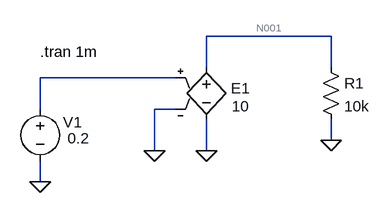
[diagram p0: schematic VoltageSource_VoltageDependent.asc]
VoltageSource_VoltageDependent.asc, the LTspice schematic file:
Version 4.1
SHEET 1 880 680
WIRE 448 48 256 48
WIRE 256 96 256 48
WIRE 448 96 448 48
WIRE 208 112 0 112
WIRE 0 160 0 112
WIRE 208 160 176 160
WIRE 448 208 448 176
WIRE 176 224 176 160
WIRE 256 224 256 176
WIRE 0 272 0 240
FLAG 256 224 0
FLAG 448 208 0
FLAG 0 272 0
FLAG 176 224 0
SYMBOL voltage 0 144 R0
WINDOW 123 0 0 Left 0
WINDOW 39 0 0 Left 0
WINDOW 0 35 36 Left 2
WINDOW 3 42 61 Left 2
SYMATTR InstName V1
SYMATTR Value 0.2
SYMBOL e 256 80 R0
WINDOW 0 38 48 Left 2
WINDOW 3 39 76 Left 2
SYMATTR InstName E1
SYMATTR Value 10
SYMBOL res 432 80 R0
SYMATTR InstName R1
SYMATTR Value 10k
TEXT 0 72 Left 2 !.tran 1m

The netlist it stands for:
* VoltageSource_VoltageDependent.asc
V1 N002 0 0.2
E1 N001 0 N002 0 10
R1 N001 0 10k
.tran 1m
.backanno
.end

* Results of the author's LTspice run, read from the files saved beside the schematic
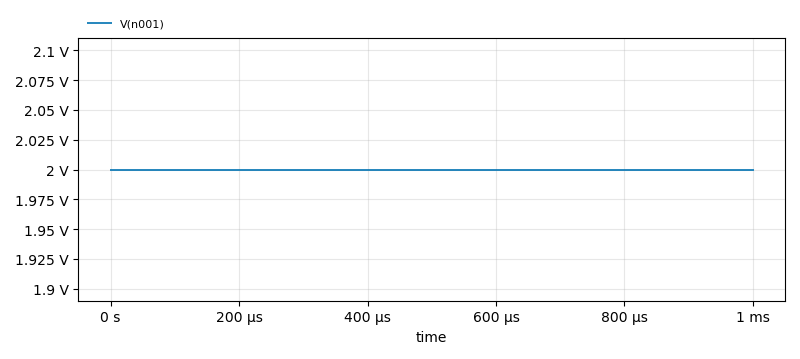
[diagram p1: Transient Analysis of VoltageSource_VoltageDependent.asc, plotted from the saved traces]
* Transient Analysis, 1 run:
*   V(n001): min 2 V, max 2 V, average 2 V, rms 2 V, last 2 V